# Altium project FMC_ADC_100M_10B_16CHA_TDC.PrjPCB (part 4 of 4)

## Sheet Translators.SchDoc: FMC_ADC
size 420 x 297 mm; Author: G.Kasprowicz; CompanyName: WUT ISE; DrawnBy: G.Kasprowicz; Organization: WUT ISE; Address1: PW ISE; Address2: Nowowiejska 15/19 00-665 Warsaw; Address3: gkasprow@gmail.com; DocumentNumber: 12; Revision: 2; SheetNumber: 12; SheetTotal: 12; ModifiedBy: -; CheckedDate: -; Title2: 100M_10B_16CHA_TDC; DivGrp: WUT ISE; Designer: G.Kasprowicz; ModifiedDate: -; ProjectName: Sensor Box
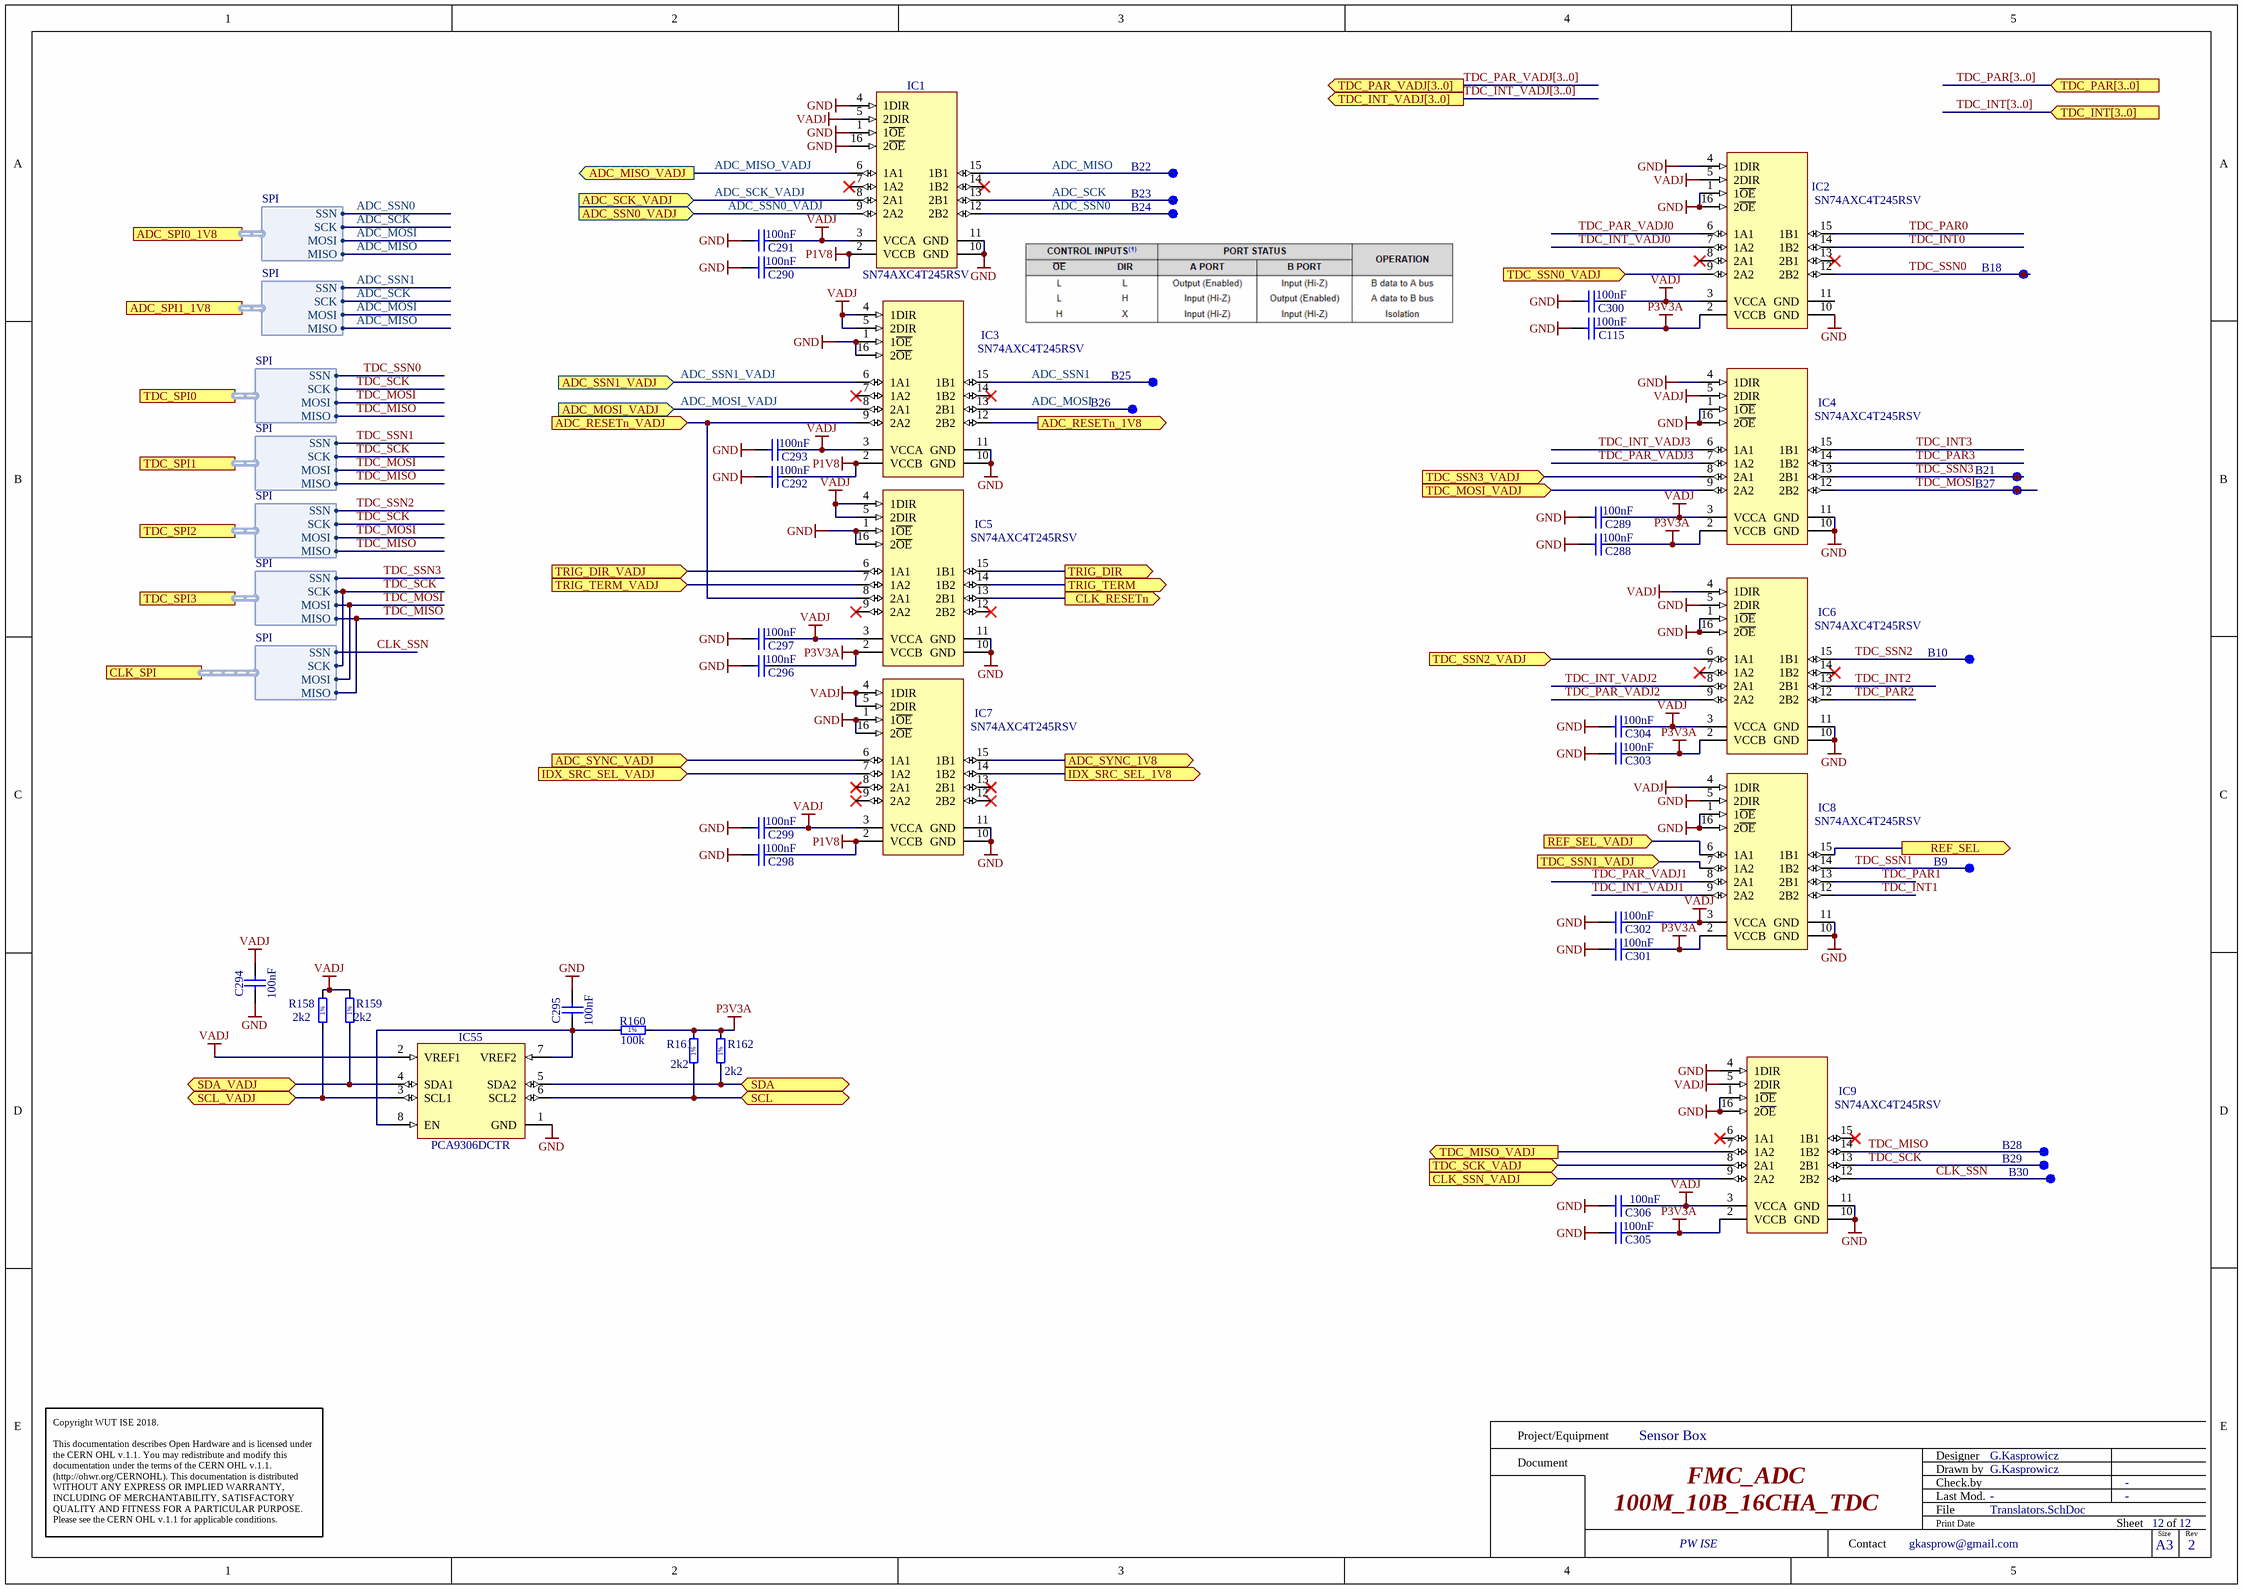
[diagram p10: Translators.SchDoc]

### Parts
B9  SMD Pad  [C100]  (value not drawn)
B10  SMD Pad  [C100]  (value not drawn)
B18  SMD Pad  [C100]  (value not drawn)
B21  SMD Pad  [C100]  (value not drawn)
B22  SMD Pad  [C100]  (value not drawn)
B23  SMD Pad  [C100]  (value not drawn)
B24  SMD Pad  [C100]  (value not drawn)
B25  SMD Pad  [C100]  (value not drawn)
B26  SMD Pad  [C100]  (value not drawn)
B27  SMD Pad  [C100]  (value not drawn)
B28  SMD Pad  [C100]  (value not drawn)
B29  SMD Pad  [C100]  (value not drawn)
B30  SMD Pad  [C100]  (value not drawn)
C115  100nF  [CAPC0603X33N]
C288  100nF  [CAPC0603X33N]
C289  100nF  [CAPC0603X33N]
C290  100nF  [CAPC0603X33N]
C291  100nF  [CAPC0603X33N]
C292  100nF  [CAPC0603X33N]
C293  100nF  [CAPC0603X33N]
C294  100nF  [CAPC0603X33N]
C295  100nF  [CAPC0603X33N]
C296  100nF  [CAPC0603X33N]
C297  100nF  [CAPC0603X33N]
C298  100nF  [CAPC0603X33N]
C299  100nF  [CAPC0603X33N]
C300  100nF  [CAPC0603X33N]
C301  100nF  [CAPC0603X33N]
C302  100nF  [CAPC0603X33N]
C303  100nF  [CAPC0603X33N]
C304  100nF  [CAPC0603X33N]
C305  100nF  [CAPC0603X33N]
C306  100nF  [CAPC0603X33N]
IC1  SN74AXC4T245RSV  [QFN40P180X260X55-16N]
IC2  SN74AXC4T245RSV  [QFN40P180X260X55-16N]
IC3  SN74AXC4T245RSV  [QFN40P180X260X55-16N]
IC4  SN74AXC4T245RSV  [QFN40P180X260X55-16N]
IC5  SN74AXC4T245RSV  [QFN40P180X260X55-16N]
IC6  SN74AXC4T245RSV  [QFN40P180X260X55-16N]
IC7  SN74AXC4T245RSV  [QFN40P180X260X55-16N]
IC8  SN74AXC4T245RSV  [QFN40P180X260X55-16N]
IC9  SN74AXC4T245RSV  [QFN40P180X260X55-16N]
IC55  PCA9306DCTR  [SOP65P400X130-8N]
R158  2k2  [RESC1005X40N]
R159  2k2  [RESC1005X40N]
R160  100k  [RESC1005X40N]
R161  2k2  [RESC1005X40N]
R162  2k2  [RESC1005X40N]

### Ports
ADC_MISO_VADJ (out), ADC_MOSI_VADJ (in), ADC_RESETn_1V8 (out), ADC_RESETn_VADJ (in), ADC_SCK_VADJ (in), ADC_SPI0_1V8 (harness SPI), ADC_SPI1_1V8 (harness SPI), ADC_SSN0_VADJ (in), ADC_SSN1_VADJ (in), ADC_SYNC_1V8 (out), ADC_SYNC_VADJ (in), CLK_RESETn (out), CLK_SPI (harness SPI), CLK_SSN_VADJ (in), IDX_SRC_SEL_1V8 (out), IDX_SRC_SEL_VADJ (in), REF_SEL (out), REF_SEL_VADJ (in), SCL (bidir), SCL_VADJ (bidir), SDA (bidir), SDA_VADJ (bidir), TDC_INT[3..0] (in), TDC_INT_VADJ[3..0] (out), TDC_MISO_VADJ (out), TDC_MOSI_VADJ (in), TDC_PAR[3..0] (in), TDC_PAR_VADJ[3..0] (out), TDC_SCK_VADJ (in), TDC_SPI0 (harness SPI), TDC_SPI1 (harness SPI), TDC_SPI2 (harness SPI), TDC_SPI3 (harness SPI), TDC_SSN0_VADJ (in), TDC_SSN1_VADJ (in), TDC_SSN2_VADJ (in), TDC_SSN3_VADJ (in), TRIG_DIR (out), TRIG_DIR_VADJ (in), TRIG_TERM (out), TRIG_TERM_VADJ (in)

### Harnesses
SPI: MISO, MOSI, SCK, SSN

### Nets
GND: C115.2 C288.2 C289.2 C290.2 C291.2 C292.2 C293.2 C294.1 C295.2 C296.2 C297.2 C298.2 C299.2 C300.2 C301.2 C302.2 C303.2 C304.2 C305.2 C306.2 IC1.1(1~{OE}) IC1.4(1DIR) IC1.10(GND) IC1.11(GND) IC1.16(2~{OE}) IC2.1(1~{OE}) IC2.4(1DIR) IC2.10(GND) IC2.16(2~{OE}) IC3.1(1~{OE}) IC3.10(GND) IC3.11(GND) IC3.16(2~{OE}) IC4.1(1~{OE}) IC4.4(1DIR) IC4.10(GND) IC4.11(GND) IC4.16(2~{OE}) IC5.1(1~{OE}) IC5.10(GND) IC5.11(GND) IC5.16(2~{OE}) IC6.1(1~{OE}) IC6.5(2DIR) IC6.10(GND) IC6.11(GND) IC6.16(2~{OE}) IC7.1(1~{OE}) IC7.10(GND) IC7.11(GND) IC7.16(2~{OE}) IC8.1(1~{OE}) IC8.5(2DIR) IC8.10(GND) IC8.11(GND) IC8.16(2~{OE}) IC9.1(1~{OE}) IC9.4(1DIR) IC9.10(GND) IC9.11(GND) IC9.16(2~{OE}) IC55.1(GND)
P1V8: C290.1 C292.1 C298.1 IC1.2(VCCB) IC3.2(VCCB) IC7.2(VCCB)
P3V3A: C115.1 C288.1 C296.1 C301.1 C303.1 C305.1 IC2.2(VCCB) IC4.2(VCCB) IC5.2(VCCB) IC6.2(VCCB) IC8.2(VCCB) IC9.2(VCCB) R160.2 R161.2 R162.2  [project net DVDD33]
VADJ: C289.1 C291.1 C293.1 C294.2 C297.1 C299.1 C300.1 C302.1 C304.1 C306.1 IC1.3(VCCA) IC1.5(2DIR) IC2.3(VCCA) IC2.5(2DIR) IC3.3(VCCA) IC3.4(1DIR) IC3.5(2DIR) IC4.3(VCCA) IC4.5(2DIR) IC5.3(VCCA) IC5.4(1DIR) IC5.5(2DIR) IC6.3(VCCA) IC6.4(1DIR) IC7.3(VCCA) IC7.4(1DIR) IC7.5(2DIR) IC8.3(VCCA) IC8.4(1DIR) IC9.3(VCCA) IC9.5(2DIR) IC55.2(VREF1) R158.2 R159.2
ADC_MISO: B22.1 IC1.15(1B1) ; port ADC_SPI0_1V8.MISO, port ADC_SPI1_1V8.MISO
ADC_MISO_VADJ: IC1.6(1A1) ; port ADC_MISO_VADJ
ADC_MOSI: B26.1 IC3.13(2B1) ; port ADC_SPI0_1V8.MOSI, port ADC_SPI1_1V8.MOSI
ADC_MOSI_VADJ: IC3.8(2A1) ; port ADC_MOSI_VADJ
ADC_RESETn_1V8: IC3.12(2B2) ; port ADC_RESETn_1V8
ADC_SCK: B23.1 IC1.13(2B1) ; port ADC_SPI0_1V8.SCK, port ADC_SPI1_1V8.SCK
ADC_SCK_VADJ: IC1.8(2A1) ; port ADC_SCK_VADJ
ADC_SSN0: B24.1 IC1.12(2B2) ; port ADC_SPI0_1V8.SSN
ADC_SSN0_VADJ: IC1.9(2A2) ; port ADC_SSN0_VADJ
ADC_SSN1: B25.1 IC3.15(1B1) ; port ADC_SPI1_1V8.SSN
ADC_SSN1_VADJ: IC3.6(1A1) ; port ADC_SSN1_VADJ
ADC_SYNC_1V8: IC7.15(1B1) ; port ADC_SYNC_1V8
CLK_SSN: B30.1 IC9.12(2B2) ; port CLK_SPI.SSN
DAC_SCL: IC55.6(SCL2) R161.1 ; port SCL
DAC_SDA: IC55.5(SDA2) R162.1 ; port SDA
HA20_N: IC4.8(2A1) ; port TDC_SSN3_VADJ
IDX_SRC_SEL_1V8: IC7.14(1B2) ; port IDX_SRC_SEL_1V8
LA12_P: IC6.6(1A1) ; port TDC_SSN2_VADJ
LA13_N: IC5.6(1A1) ; port TRIG_DIR_VADJ
LA13_P: IC4.9(2A2) ; port TDC_MOSI_VADJ
LA14_N: IC9.9(2A2) ; port CLK_SSN_VADJ
LA14_P: IC5.7(1A2) ; port TRIG_TERM_VADJ
LA15_N: IC9.8(2A1) ; port TDC_SCK_VADJ
LA15_P: IC3.9(2A2) IC5.8(2A1) ; port ADC_RESETn_VADJ
LA16_N: IC9.7(1A2) ; port TDC_MISO_VADJ
LA27_N: IC55.3(SCL1) R158.1 ; port SCL_VADJ
LA27_P: IC55.4(SDA1) R159.1 ; port SDA_VADJ
LA29_P: IC8.6(1A1) ; port REF_SEL_VADJ
LA30_N: IC7.7(1A2) ; port IDX_SRC_SEL_VADJ
LA30_P: IC7.6(1A1) ; port ADC_SYNC_VADJ
LA31_N: IC2.9(2A2) ; port TDC_SSN0_VADJ
LA31_P: IC8.7(1A2) ; port TDC_SSN1_VADJ
REF_SEL: IC8.15(1B1) ; port REF_SEL
TDC_INT0: IC2.14(1B2)
TDC_INT1: IC8.12(2B2)
TDC_INT2: IC6.13(2B1)
TDC_INT3: IC4.15(1B1)
TDC_INT_VADJ0: IC2.7(1A2)  [project net LA33_N]
TDC_INT_VADJ1: IC8.9(2A2)  [project net LA28_N]
TDC_INT_VADJ2: IC6.8(2A1)  [project net LA12_N]
TDC_INT_VADJ3: IC4.6(1A1)  [project net HA19_P]
TDC_MISO: B28.1 IC9.14(1B2) ; port TDC_SPI0.MISO, port TDC_SPI1.MISO, port TDC_SPI2.MISO, port TDC_SPI3.MISO, port CLK_SPI.MISO
TDC_MOSI: B27.1 IC4.12(2B2) ; port TDC_SPI0.MOSI, port TDC_SPI1.MOSI, port TDC_SPI2.MOSI, port TDC_SPI3.MOSI, port CLK_SPI.MOSI
TDC_PAR0: IC2.15(1B1)
TDC_PAR1: IC8.13(2B1)
TDC_PAR2: IC6.12(2B2)
TDC_PAR3: IC4.14(1B2)
TDC_PAR_VADJ0: IC2.6(1A1)  [project net LA33_P]
TDC_PAR_VADJ1: IC8.8(2A1)  [project net LA28_P]
TDC_PAR_VADJ2: IC6.9(2A2)  [project net LA11_P]
TDC_PAR_VADJ3: IC4.7(1A2)  [project net HA19_N]
TDC_SCK: B29.1 IC9.13(2B1) ; port TDC_SPI0.SCK, port TDC_SPI1.SCK, port TDC_SPI2.SCK, port TDC_SPI3.SCK, port CLK_SPI.SCK
TDC_SSN0: B18.1 IC2.12(2B2) ; port TDC_SPI0.SSN
TDC_SSN1: B9.1 IC8.14(1B2) ; port TDC_SPI1.SSN
TDC_SSN2: B10.1 IC6.15(1B1) ; port TDC_SPI2.SSN
TDC_SSN3: B21.1 IC4.13(2B1) ; port TDC_SPI3.SSN
TRIG_DIR: IC5.15(1B1) ; port TRIG_DIR
TRIG_TERM: IC5.14(1B2) ; port TRIG_TERM
NetC295_1: C295.1 IC55.7(VREF2) IC55.8(EN) R160.1
NetIC5_13: IC5.13(2B1) ; port CLK_RESETn

Not connected (* = marked no-connect by the designer): IC1 7(1A2)* 14(1B2)*; IC2 8(2A1)* 11(GND) 13(2B1)*; IC3 7(1A2)* 14(1B2)*; IC5 9(2A2)* 12(2B2)*; IC6 7(1A2)* 14(1B2)*; IC7 8(2A1)* 9(2A2)* 12(2B2)* 13(2B1)*; IC9 6(1A1)* 15(1B1)*

### Buses and harness runs
bus TDC_INT[3..0] = port TDC_INT[3..0]
bus TDC_INT_VADJ[3..0] = port TDC_INT_VADJ[3..0]
bus TDC_PAR[3..0] = port TDC_PAR[3..0]
bus TDC_PAR_VADJ[3..0] = port TDC_PAR_VADJ[3..0]

### Notes on the sheet
- Project/Equipment
- Document
- Designer
- Drawn by
- Check.by
- Copyright WUT ISE 2018.
  This documentation describes Open Hardware and is licensed under the CERN OHL v.1.1. You may redistribute and modify this documentation under the terms of the CERN OHL v.1.1. (http://ohwr.org/CERNOHL). This documentation is distributed WITHOUT ANY EXPRESS OR IMPLIED WARRANTY, INCLUDING OF MERCHANTABILITY, SATISFACTORY QUALITY AND FITNESS FOR A PARTICULAR PURPOSE. Please see the CERN OHL v.1.1 for applicable conditions.
- Contact
- File
- Last Mod.
- Print Date
- Sheet
- Size
- A3
- of
- Rev
- (in symbol R0402_2K2_1%_0.0625W_100PPM) 1%
- (in symbol R0402_100K_1%_0.0625W_100PPM) 1%

### Library data of the parts
B9 B10 B18 B21-B30 = SMD_PAD_D1MM: Through Hole Pad; Part Description: 1mm Diameter SMD Pad; Mounted: No; Part Number: SMD_PAD_D1MM; Component Kind: Standard (No BOM); Component Type: Standard (No BOM); Pin Count: 1; Family: SMD Pad; Socket: No; SMD: No; Sense: No; Status: None; ComponentHeight: 0mm; HelpURL: Undefined; Author: CERN DEM JLC; CreateDate: 10.10.2017; LatestRevisionDate: 10.10.2017; PackageDescription: 1mm Diameter SMD Pad
C115 C288-C306 = CC0201_100NF_6.3V_10%_X5R: Non-polarised capacitor; Manufacturer: GENERIC; Part Description: SMD Multilayer Chip Ceramic Capacitor; Manufacturer1 Part Number: 02016D104KAT2A; Tolerance: ±10%; Voltage: 6.3V; TC: X5R; Manufacturer Part Number: CC0201_100NF_6.3V_10%_X5R; Part Number: CC0201_100NF_6.3V_10%_X5R; Value: 100nF; Component Kind: Standard; Component Type: Standard; Pin Count: 2; Status: Not Recommended; Case: 0201; Mounted: Yes; Socket: No; SMD: Yes; Sense: No; Manufacturer1 Example: AVX; Manufacturer1 ComponentHeight: 0.33mm; HelpURL: \\cern.ch\dfs\Applications\Altium\Datasheets\CC0201_X5R_AVX.pdf; Author: CERN DEM JLC; CreateDate: 03.12.2007; LatestRevisionDate: 03.12.2007
IC1-IC9 = SN74AXC4T245: 4-Bit Dual-Supply Bus Transceiver with Configurable Voltage Translation and 3-State Output; Part Description: 4-Bit Dual-Supply Bus Transceiver With Configurable Voltage Translation and 3-State Outputs; Manufacturer: TEXAS INSTRUMENTS; PressFit: No; Bonding: No; Part Number: SN74AXC4T245RSV; Component Kind: Standard; Component Type: Standard; Device: SN74AXC4T245RSV; PackageDescription: QFN, 0.40mm Pitch, Rect.; 16 Pin, 2.60mm L X 1.80mm W X 0.55mm H Body, IPC Medium Density; Status: Recommended; Manufacturer Part Number: SN74AXC4T245RSV; Pin Count: 16; Case: QFN16; Mounted: Yes; Socket: No; SMD: Yes; Sense: No; ComponentHeight: 0.55mm; Author: GK; HelpURL: \\cern.ch\dfs\Applications\Altium\Datasheets\SN74AVC4T245RSVR.pdf; CreateDate: 08.07.2014; LatestRevisionDate: 30.03.2017
IC55 = PCA9306DCTR: Dual Bidirectional I2C Bus And SMBus Voltage-Level Translator; Manufacturer: TEXAS INSTRUMENTS; Table: Analog & Interface; Part Number: PCA9306DCTR; Component Kind: Standard; Component Type: Standard; Device: PCA9306DCTR; PackageDescription: SOP, 0.65mm, Pitch; 8 Pin, 2.80mm W X 2.95mm L X 1.30mm H Body, PC Medium Density; Part Description: Dual Bidirectional I2C Bus And SMBus Voltage-Level Translator; Manufacturer Part Number: PCA9306DCTR; Pin Count: 8; Case: SSOP8; Mounted: Yes; Socket: No; SMD: Yes; ComponentHeight: 1.3mm; Author: CERN DEM JLC; HelpURL: \\cern.ch\dfs\Applications\Altium\Datasheets\PCA9306DCTR.pdf; CreateDate: 2013-02-25; LatestRevisionDate: 2013-02-25
R158 R159 R161 R162 = R0402_2K2_1%_0.0625W_100PPM: Resistor - 1%; Part Description: General Purpose Thick Film Chip Resistor; Manufacturer: GENERIC; Manufacturer1 Part Number: 232270672202L; TC: ±100ppm/°C; Table: Resistors SMD; Part Number: R0402_2K2_1%_0.0625W_100PPM; Component Kind: Standard; Component Type: Standard; Pin Count: 2; Value: 2k2; Status: Not recommended; Power: 0.0625W; Tolerance: ±1%; Manufacturer Part Number: R0402_2K2_1%_0.0625W_100PPM; Case: 0402; Mounted: Yes; Socket: No; SMD: Yes; Manufacturer1 Example: YAGEO PHYCOMP; Manufacturer1 ComponentHeight: 0.4mm; HelpURL: \\cern.ch\dfs\Applications\Altium\Datasheets\R0402_Phycomp_RC0402.pdf; Author: CERN DEM JLC; CreateDate: 2007-12-03; LatestRevisionDate: 2012-10-17
R160 = R0402_100K_1%_0.0625W_100PPM: Resistor - 1%; Part Description: General Purpose Thick Film Chip Resistor; Manufacturer: GENERIC; Manufacturer1 Part Number: 232270671004L; TC: ±100ppm/°C; Table: Resistors SMD; Part Number: R0402_100K_1%_0.0625W_100PPM; Component Kind: Standard; Component Type: Standard; Pin Count: 2; Value: 100k; Status: Not recommended; Power: 0.0625W; Tolerance: ±1%; Manufacturer Part Number: R0402_100K_1%_0.0625W_100PPM; Case: 0402; Mounted: Yes; Socket: No; SMD: Yes; Manufacturer1 Example: YAGEO PHYCOMP; Manufacturer1 ComponentHeight: 0.4mm; HelpURL: \\cern.ch\dfs\Applications\Altium\Datasheets\R0402_Phycomp_RC0402.pdf; Author: CERN DEM JLC; CreateDate: 2007-12-03; LatestRevisionDate: 2012-10-17

## Sheet SAS_Connectors.SchDoc: FMC_ADC
size 420 x 297 mm; Author: G.Kasprowicz; CompanyName: WUT ISE; DrawnBy: G.Kasprowicz; Organization: WUT ISE; Address1: PW ISE; Address2: Nowowiejska 15/19 00-665 Warsaw; Address3: gkasprow@gmail.com; DocumentNumber: 2; Revision: 2; SheetNumber: 2; SheetTotal: 12; ModifiedBy: -; CheckedDate: -; Title2: 100M_10B_16CHA_TDC; DivGrp: WUT ISE; Designer: G.Kasprowicz; ModifiedDate: -; ProjectName: Sensor Box
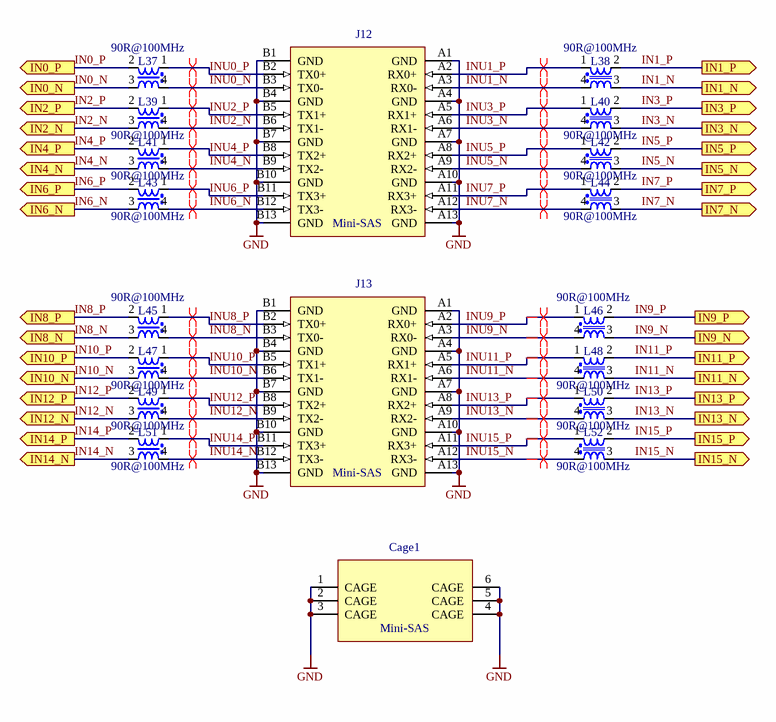
[diagram p11: SAS_Connectors.SchDoc]

### Parts
Cage1  Mini-SAS  [TYCO_1888321-2]
J12  Mini-SAS  [TYCO_1761987-7]
J13  Mini-SAS  [TYCO_1761987-7]
L37  90R@100MHz  [IND_MURATA_DLW21S]
L38  90R@100MHz  [IND_MURATA_DLW21S]
L39  90R@100MHz  [IND_MURATA_DLW21S]
L40  90R@100MHz  [IND_MURATA_DLW21S]
L41  90R@100MHz  [IND_MURATA_DLW21S]
L42  90R@100MHz  [IND_MURATA_DLW21S]
L43  90R@100MHz  [IND_MURATA_DLW21S]
L44  90R@100MHz  [IND_MURATA_DLW21S]
L45  90R@100MHz  [IND_MURATA_DLW21S]
L46  90R@100MHz  [IND_MURATA_DLW21S]
L47  90R@100MHz  [IND_MURATA_DLW21S]
L48  90R@100MHz  [IND_MURATA_DLW21S]
L49  90R@100MHz  [IND_MURATA_DLW21S]
L50  90R@100MHz  [IND_MURATA_DLW21S]
L51  90R@100MHz  [IND_MURATA_DLW21S]
L52  90R@100MHz  [IND_MURATA_DLW21S]

### Ports
IN0_N (out), IN0_P (out), IN1_N (out), IN1_P (out), IN2_N (out), IN2_P (out), IN3_N (out), IN3_P (out), IN4_N (out), IN4_P (out), IN5_N (out), IN5_P (out), IN6_N (out), IN6_P (out), IN7_N (out), IN7_P (out), IN8_N (out), IN8_P (out), IN9_N (out), IN9_P (out), IN10_N (out), IN10_P (out), IN11_N (out), IN11_P (out), IN12_N (out), IN12_P (out), IN13_N (out), IN13_P (out), IN14_N (out), IN14_P (out), IN15_N (out), IN15_P (out)

### Nets
GND: Cage1.1(CAGE) Cage1.2(CAGE) Cage1.3(CAGE) Cage1.4(CAGE) Cage1.5(CAGE) Cage1.6(CAGE) J12.A1(GND) J12.A4(GND) J12.A7(GND) J12.A10(GND) J12.A13(GND) J12.B1(GND) J12.B4(GND) J12.B7(GND) J12.B10(GND) J12.B13(GND) J13.A1(GND) J13.A4(GND) J13.A7(GND) J13.A10(GND) J13.A13(GND) J13.B1(GND) J13.B4(GND) J13.B7(GND) J13.B10(GND) J13.B13(GND)
IN0_N: L37.3 ; port IN0_N
IN0_P: L37.2 ; port IN0_P
IN1_N: L38.3 ; port IN1_N
IN1_P: L38.2 ; port IN1_P
IN2_N: L39.3 ; port IN2_N
IN2_P: L39.2 ; port IN2_P
IN3_N: L40.3 ; port IN3_N
IN3_P: L40.2 ; port IN3_P
IN4_N: L41.3 ; port IN4_N
IN4_P: L41.2 ; port IN4_P
IN5_N: L42.3 ; port IN5_N
IN5_P: L42.2 ; port IN5_P
IN6_N: L43.3 ; port IN6_N
IN6_P: L43.2 ; port IN6_P
IN7_N: L44.3 ; port IN7_N
IN7_P: L44.2 ; port IN7_P
IN8_N: L45.3 ; port IN8_N
IN8_P: L45.2 ; port IN8_P
IN9_N: L46.3 ; port IN9_N
IN9_P: L46.2 ; port IN9_P
IN10_N: L47.3 ; port IN10_N
IN10_P: L47.2 ; port IN10_P
IN11_N: L48.3 ; port IN11_N
IN11_P: L48.2 ; port IN11_P
IN12_N: L49.3 ; port IN12_N
IN12_P: L49.2 ; port IN12_P
IN13_N: L50.3 ; port IN13_N
IN13_P: L50.2 ; port IN13_P
IN14_N: L51.3 ; port IN14_N
IN14_P: L51.2 ; port IN14_P
IN15_N: L52.3 ; port IN15_N
IN15_P: L52.2 ; port IN15_P
INU0_N: J12.B3(TX0-) L37.4
INU0_P: J12.B2(TX0+) L37.1
INU1_N: J12.A3(RX0-) L38.4
INU1_P: J12.A2(RX0+) L38.1
INU2_N: J12.B6(TX1-) L39.4
INU2_P: J12.B5(TX1+) L39.1
INU3_N: J12.A6(RX1-) L40.4
INU3_P: J12.A5(RX1+) L40.1
INU4_N: J12.B9(TX2-) L41.4
INU4_P: J12.B8(TX2+) L41.1
INU5_N: J12.A9(RX2-) L42.4
INU5_P: J12.A8(RX2+) L42.1
INU6_N: J12.B12(TX3-) L43.4
INU6_P: J12.B11(TX3+) L43.1
INU7_N: J12.A12(RX3-) L44.4
INU7_P: J12.A11(RX3+) L44.1
INU8_N: J13.B3(TX0-) L45.4
INU8_P: J13.B2(TX0+) L45.1
INU9_N: J13.A3(RX0-) L46.4
INU9_P: J13.A2(RX0+) L46.1
INU10_N: J13.B6(TX1-) L47.4
INU10_P: J13.B5(TX1+) L47.1
INU11_N: J13.A6(RX1-) L48.4
INU11_P: J13.A5(RX1+) L48.1
INU12_N: J13.B9(TX2-) L49.4
INU12_P: J13.B8(TX2+) L49.1
INU13_N: J13.A9(RX2-) L50.4
INU13_P: J13.A8(RX2+) L50.1
INU14_N: J13.B12(TX3-) L51.4
INU14_P: J13.B11(TX3+) L51.1
INU15_N: J13.A12(RX3-) L52.4
INU15_P: J13.A11(RX3+) L52.1

### Layout directives
differential pair: INU0_N, INU0_P, INU1_N, INU1_P, INU2_N, INU2_P, INU3_N, INU3_P, INU4_N, INU4_P, INU5_N, INU5_P, INU6_N, INU6_P, INU7_N, INU7_P, INU8_N, INU8_P, INU9_N, INU9_P, INU10_N, INU10_P, INU11_N, INU11_P, INU12_N, INU12_P, INU13_N, INU13_P, INU14_N, INU14_P, INU15_N, INU15_P

### Notes on the sheet
- Project/Equipment
- Document
- Designer
- Drawn by
- Check.by
- Copyright WUT ISE 2018.
  This documentation describes Open Hardware and is licensed under the CERN OHL v.1.1. You may redistribute and modify this documentation under the terms of the CERN OHL v.1.1. (http://ohwr.org/CERNOHL). This documentation is distributed WITHOUT ANY EXPRESS OR IMPLIED WARRANTY, INCLUDING OF MERCHANTABILITY, SATISFACTORY QUALITY AND FITNESS FOR A PARTICULAR PURPOSE. Please see the CERN OHL v.1.1 for applicable conditions.
- Contact
- File
- Last Mod.
- Print Date
- Sheet
- Size
- A3
- of
- Rev

### Library data of the parts
Cage1 = TYCO_1888321-2: Mini-SAS Cage (6Pins); Part Description: Through Hole Dual Port EVERCLEAR Mini-SAS Cage; Manufacturer: TYCO ELECTRONICS; PressFit: No; Part Number: TYCO_1888321-2; Component Kind: Standard; Component Type: Standard; Pin Count: 10; Family: Mini-SAS; Mounted: Yes; Socket: No; SMD: No; Sense: No; Status: None; Manufacturer Part Number: 1888321-2; ComponentHeight: 8.63mm; HelpURL: \\cern.ch\dfs\Applications\Altium\Datasheets\TYCO_1888321-2.pdf; Author: CERN DEM BC; CreateDate: 04.04.2019; LatestRevisionDate: 04.04.2019
J12 J13 = TYCO_1761987-7: 26 Position Mini-Sas Connector (Quad Small Form-Factor SFF-8088); Part Description: Surface Mount EVERCLEAR Mini-SAS Right Angle Receptacle (Quad Small Form-Factor SFF-8088); Manufacturer: TYCO ELECTRONICS; PressFit: No; Part Number: TYCO_1761987-7; Component Kind: Standard; Component Type: Standard; Pin Count: 26; Family: Mini-SAS; Mounted: Yes; Socket: No; SMD: Yes; Sense: No; Status: None; Manufacturer Part Number: 1761987-7; ComponentHeight: 5.55mm; HelpURL: \\cern.ch\dfs\Applications\Altium\Datasheets\TYCO_1761987-7.pdf; Author: CERN DEM MR; CreateDate: 24.04.2019; LatestRevisionDate: 24.04.2019
L37-L52 = IND_MURATA_DLW21SN900SQ2L: Inductor Common Mode; Part Description: Wire Wound Common Mode Choke Coil (DLW21S Series); Manufacturer: MURATA; Power: 330mA; Resistance: 0.35R; Tolerance: ±25%; Part Number: IND_MURATA_DLW21SN900SQ2L; Component Kind: Standard; Component Type: Standard; Pin Count: 4; Value: 90R@100MHz; Status: None; Manufacturer Part Number: DLW21SN900SQ2L; Case: 0805; Mounted: Yes; Socket: No; SMD: Yes; Sense: No; ComponentHeight: 1.4mm; HelpURL: \\cern.ch\dfs\Applications\Altium\Datasheets\IND_MURATA_DLW21S.pdf; Author: CERN DEM JLC; CreateDate: 01.07.2014; LatestRevisionDate: 01.07.2014

## Nets that join several sheets
3P3VAUX: EEPROM_Temp (12 pins), FMC connector (J11.d32)
DVDD33: U_TDC0 (6 pins), power_supply (C275.1 J8.29 J8.30), IDX_CTRL (C181.1 C182.1 D3.2 IC41.8), U_TDC1 (6 pins), U_TDC2 (6 pins), U_TDC3 (6 pins), DACs (9 pins), Translators (15 pins)
GND: FMC_ADC_100M_10B_16CHA_TDC (J10.2 R118.1), U_ADC0 (20 pins), U_TDC0 (23 pins), Clock_circuit (33 pins), EEPROM_Temp (14 pins), FMC connector (164 pins), power_supply (13 pins), IDX_CTRL (10 pins), U_TDC1 (23 pins), U_TDC2 (23 pins), U_TDC3 (23 pins), U_CFD0 (9 pins), DACs (18 pins), U_CFD1 (9 pins), U_CFD2 (9 pins), U_CFD3 (9 pins), U_CFD4 (9 pins), U_CFD5 (9 pins), U_CFD6 (9 pins), U_CFD7 (9 pins), U_CFD8 (9 pins), U_CFD9 (9 pins), U_CFD10 (9 pins), U_CFD11 (9 pins), U_CFD12 (9 pins), U_CFD13 (9 pins), U_CFD14 (9 pins), U_CFD15 (9 pins), U_ADC1 (20 pins), Translators (62 pins), SAS_Connectors (26 pins)
N3V0A: power_supply (J8.7 J8.8), U_CFD0 (C102A.1 IC20A.6), U_CFD1 (C102B.1 IC20B.6), U_CFD2 (C102C.1 IC20C.6), U_CFD3 (C102D.1 IC20D.6), U_CFD4 (C102E.1 IC20E.6), U_CFD5 (C102F.1 IC20F.6), U_CFD6 (C102G.1 IC20G.6), U_CFD7 (C102H.1 IC20H.6), U_CFD8 (C102I.1 IC20I.6), U_CFD9 (C102J.1 IC20J.6), U_CFD10 (C102K.1 IC20K.6), U_CFD11 (C102L.1 IC20L.6), U_CFD12 (C102M.1 IC20M.6), U_CFD13 (C102N.1 IC20N.6), U_CFD14 (C102O.1 IC20O.6), U_CFD15 (C102P.1 IC20P.6)
P1V8: U_ADC0 (5 pins), power_supply (J8.17 J8.18), IDX_CTRL (L14.1), U_ADC1 (5 pins), Translators (6 pins)
P3V3: FMC connector (5 pins), power_supply (J8.21 J8.22), U_CFD0 (C105A.1 IC32A.5), U_CFD1 (C105B.1 IC32B.5), U_CFD2 (C105C.1 IC32C.5), U_CFD3 (C105D.1 IC32D.5), U_CFD4 (C105E.1 IC32E.5), U_CFD5 (C105F.1 IC32F.5), U_CFD6 (C105G.1 IC32G.5), U_CFD7 (C105H.1 IC32H.5), U_CFD8 (C105I.1 IC32I.5), U_CFD9 (C105J.1 IC32J.5), U_CFD10 (C105K.1 IC32K.5), U_CFD11 (C105L.1 IC32L.5), U_CFD12 (C105M.1 IC32M.5), U_CFD13 (C105N.1 IC32N.5), U_CFD14 (C105O.1 IC32O.5), U_CFD15 (C105P.1 IC32P.5)
P3V3_CLK: Clock_circuit (39 pins), power_supply (J8.1 J8.2)
P5V0A: power_supply (J8.13 J8.14), U_CFD0 (C101A.1 IC20A.3), U_CFD1 (C101B.1 IC20B.3), U_CFD2 (C101C.1 IC20C.3), U_CFD3 (C101D.1 IC20D.3), U_CFD4 (C101E.1 IC20E.3), U_CFD5 (C101F.1 IC20F.3), U_CFD6 (C101G.1 IC20G.3), U_CFD7 (C101H.1 IC20H.3), U_CFD8 (C101I.1 IC20I.3), U_CFD9 (C101J.1 IC20J.3), U_CFD10 (C101K.1 IC20K.3), U_CFD11 (C101L.1 IC20L.3), U_CFD12 (C101M.1 IC20M.3), U_CFD13 (C101N.1 IC20N.3), U_CFD14 (C101O.1 IC20O.3), U_CFD15 (C101P.1 IC20P.3)
P12V0: FMC connector (J11.c35 J11.c37), power_supply (J8.3 J8.4)
REF2V5: FMC_ADC_100M_10B_16CHA_TDC (R117.1), DACs (C147.1 IC35.8 IC36.8 IC37.2)
VADJ: FMC connector (J11.e39 J11.f40 J11.g39 J11.h40), power_supply (R138.1), Translators (34 pins)
ADC_CLK_N: U_ADC0 (C98A.1 R47A.1), Clock_circuit (IC34.38)
ADC_CLK_N: Clock_circuit (IC34.53), U_ADC1 (C98B.1 R47B.1)
ADC_CLK_P: U_ADC0 (C97A.1 R47A.2), Clock_circuit (IC34.37)
ADC_CLK_P: Clock_circuit (IC34.52), U_ADC1 (C97B.1 R47B.2)
ADC_IN0.SIG_N: U_ADC0 (IC14A.11), U_CFD0 (C100A.1 R60A.2)
ADC_IN0.SIG_P: U_ADC0 (IC14A.10), U_CFD0 (R48A.2 R58A.2)
ADC_IN1.SIG_N: U_ADC0 (IC14A.8), U_CFD1 (C100B.1 R60B.2)
ADC_IN1.SIG_P: U_ADC0 (IC14A.7), U_CFD1 (R48B.2 R58B.2)
ADC_IN2.SIG_N: U_ADC0 (IC14A.5), U_CFD2 (C100C.1 R60C.2)
ADC_IN2.SIG_P: U_ADC0 (IC14A.4), U_CFD2 (R48C.2 R58C.2)
ADC_IN3.SIG_N: U_ADC0 (IC14A.2), U_CFD3 (C100D.1 R60D.2)
ADC_IN3.SIG_P: U_ADC0 (IC14A.1), U_CFD3 (R48D.2 R58D.2)
ADC_IN4.SIG_N: U_ADC0 (IC14A.48), U_CFD4 (C100E.1 R60E.2)
ADC_IN4.SIG_P: U_ADC0 (IC14A.47), U_CFD4 (R48E.2 R58E.2)
ADC_IN5.SIG_N: U_ADC0 (IC14A.45), U_CFD5 (C100F.1 R60F.2)
ADC_IN5.SIG_P: U_ADC0 (IC14A.44), U_CFD5 (R48F.2 R58F.2)
ADC_IN6.SIG_N: U_ADC0 (IC14A.42), U_CFD6 (C100G.1 R60G.2)
ADC_IN6.SIG_P: U_ADC0 (IC14A.41), U_CFD6 (R48G.2 R58G.2)
ADC_IN7.SIG_N: U_ADC0 (IC14A.39), U_CFD7 (C100H.1 R60H.2)
ADC_IN7.SIG_P: U_ADC0 (IC14A.38), U_CFD7 (R48H.2 R58H.2)
ADC_IN8.SIG_N: U_CFD8 (C100I.1 R60I.2), U_ADC1 (IC14B.11)
ADC_IN8.SIG_P: U_CFD8 (R48I.2 R58I.2), U_ADC1 (IC14B.10)
ADC_IN9.SIG_N: U_CFD9 (C100J.1 R60J.2), U_ADC1 (IC14B.8)
ADC_IN9.SIG_P: U_CFD9 (R48J.2 R58J.2), U_ADC1 (IC14B.7)
ADC_IN10.SIG_N: U_CFD10 (C100K.1 R60K.2), U_ADC1 (IC14B.5)
ADC_IN10.SIG_P: U_CFD10 (R48K.2 R58K.2), U_ADC1 (IC14B.4)
ADC_IN11.SIG_N: U_CFD11 (C100L.1 R60L.2), U_ADC1 (IC14B.2)
ADC_IN11.SIG_P: U_CFD11 (R48L.2 R58L.2), U_ADC1 (IC14B.1)
ADC_IN12.SIG_N: U_CFD12 (C100M.1 R60M.2), U_ADC1 (IC14B.48)
ADC_IN12.SIG_P: U_CFD12 (R48M.2 R58M.2), U_ADC1 (IC14B.47)
ADC_IN13.SIG_N: U_CFD13 (C100N.1 R60N.2), U_ADC1 (IC14B.45)
ADC_IN13.SIG_P: U_CFD13 (R48N.2 R58N.2), U_ADC1 (IC14B.44)
ADC_IN14.SIG_N: U_CFD14 (C100O.1 R60O.2), U_ADC1 (IC14B.42)
ADC_IN14.SIG_P: U_CFD14 (R48O.2 R58O.2), U_ADC1 (IC14B.41)
ADC_IN15.SIG_N: U_CFD15 (C100P.1 R60P.2), U_ADC1 (IC14B.39)
ADC_IN15.SIG_P: U_CFD15 (R48P.2 R58P.2), U_ADC1 (IC14B.38)
ADC_MISO: U_ADC0 (IC15A.4), U_ADC1 (IC15B.4), Translators (B22.1 IC1.15)
ADC_MISO_VADJ: FMC connector (J11.k20), Translators (IC1.6)
ADC_MOSI: U_ADC0 (IC14A.62), U_ADC1 (IC14B.62), Translators (B26.1 IC3.13)
ADC_MOSI_VADJ: FMC connector (J11.g18), Translators (IC3.8)
ADC_RESETn_1V8: U_ADC0 (IC14A.64), U_ADC1 (IC14B.64), Translators (IC3.12)
ADC_SCK: U_ADC0 (IC14A.63), U_ADC1 (IC14B.63), Translators (B23.1 IC1.13)
ADC_SCK_VADJ: FMC connector (J11.j21), Translators (IC1.8)
ADC_SSN0: U_ADC0 (IC14A.61 IC15A.1), Translators (B24.1 IC1.12)
ADC_SSN0_VADJ: FMC connector (J11.j22), Translators (IC1.9)
ADC_SSN1: U_ADC1 (IC14B.61 IC15B.1), Translators (B25.1 IC3.15)
ADC_SSN1_VADJ: FMC connector (J11.h17), Translators (IC3.6)
ADC_SYNC_1V8: U_ADC0 (IC14A.49), U_ADC1 (IC14B.49), Translators (IC7.15)
ADCLK_N: U_ADC0 (IC14A.24), FMC connector (J11.k26)
ADCLK_N: FMC connector (J11.k17), U_ADC1 (IC14B.24)
ADCLK_P: U_ADC0 (IC14A.23), FMC connector (J11.k25)
ADCLK_P: FMC connector (J11.k16), U_ADC1 (IC14B.23)
CFD_CLAMP: FMC_ADC_100M_10B_16CHA_TDC (R117.2 R118.2), U_CFD0 (IC20A.7), U_CFD1 (IC20B.7), U_CFD2 (IC20C.7), U_CFD3 (IC20D.7), U_CFD4 (IC20E.7), U_CFD5 (IC20F.7), U_CFD6 (IC20G.7), U_CFD7 (IC20H.7), U_CFD8 (IC20I.7), U_CFD9 (IC20J.7), U_CFD10 (IC20K.7), U_CFD11 (IC20L.7), U_CFD12 (IC20M.7), U_CFD13 (IC20N.7), U_CFD14 (IC20O.7), U_CFD15 (IC20P.7)
CFD_OFFSET0: U_CFD0 (R70A.1), DACs (IC35.3)
CFD_OFFSET1: DACs (IC35.16), U_CFD1 (R70B.1)
CFD_OFFSET2: DACs (IC35.4), U_CFD2 (R70C.1)
CFD_OFFSET3: DACs (IC35.15), U_CFD3 (R70D.1)
CFD_OFFSET4: DACs (IC35.5), U_CFD4 (R70E.1)
CFD_OFFSET5: DACs (IC35.14), U_CFD5 (R70F.1)
CFD_OFFSET6: DACs (IC35.6), U_CFD6 (R70G.1)
CFD_OFFSET7: DACs (IC35.13), U_CFD7 (R70H.1)
CFD_OFFSET8: DACs (IC36.3), U_CFD8 (R70I.1)
CFD_OFFSET9: DACs (IC36.16), U_CFD9 (R70J.1)
CFD_OFFSET10: DACs (IC36.4), U_CFD10 (R70K.1)
CFD_OFFSET11: DACs (IC36.15), U_CFD11 (R70L.1)
CFD_OFFSET12: DACs (IC36.5), U_CFD12 (R70M.1)
CFD_OFFSET13: DACs (IC36.14), U_CFD13 (R70N.1)
CFD_OFFSET14: DACs (IC36.6), U_CFD14 (R70O.1)
CFD_OFFSET15: DACs (IC36.13), U_CFD15 (R70P.1)
CFD_OUT0.SIG_N: U_TDC0 (IC50A.48 R140A.2), U_CFD0 (IC32A.3)
CFD_OUT0.SIG_P: U_TDC0 (IC50A.47 R140A.1), U_CFD0 (IC32A.4)
CFD_OUT1.SIG_N: U_TDC0 (IC50A.46 R141A.2), U_CFD1 (IC32B.3)
CFD_OUT1.SIG_P: U_TDC0 (IC50A.45 R141A.1), U_CFD1 (IC32B.4)
CFD_OUT2.SIG_N: U_TDC0 (IC50A.36 R142A.2), U_CFD2 (IC32C.3)
CFD_OUT2.SIG_P: U_TDC0 (IC50A.35 R142A.1), U_CFD2 (IC32C.4)
CFD_OUT3.SIG_N: U_TDC0 (IC50A.34 R143A.2), U_CFD3 (IC32D.3)
CFD_OUT3.SIG_P: U_TDC0 (IC50A.33 R143A.1), U_CFD3 (IC32D.4)
CFD_OUT4.SIG_N: U_TDC1 (IC50B.48 R140B.2), U_CFD4 (IC32E.3)
CFD_OUT4.SIG_P: U_TDC1 (IC50B.47 R140B.1), U_CFD4 (IC32E.4)
CFD_OUT5.SIG_N: U_TDC1 (IC50B.46 R141B.2), U_CFD5 (IC32F.3)
CFD_OUT5.SIG_P: U_TDC1 (IC50B.45 R141B.1), U_CFD5 (IC32F.4)
CFD_OUT6.SIG_N: U_TDC1 (IC50B.36 R142B.2), U_CFD6 (IC32G.3)
CFD_OUT6.SIG_P: U_TDC1 (IC50B.35 R142B.1), U_CFD6 (IC32G.4)
CFD_OUT7.SIG_N: U_TDC1 (IC50B.34 R143B.2), U_CFD7 (IC32H.3)
CFD_OUT7.SIG_P: U_TDC1 (IC50B.33 R143B.1), U_CFD7 (IC32H.4)
CFD_OUT8.SIG_N: U_TDC2 (IC50C.48 R140C.2), U_CFD8 (IC32I.3)
CFD_OUT8.SIG_P: U_TDC2 (IC50C.47 R140C.1), U_CFD8 (IC32I.4)
CFD_OUT9.SIG_N: U_TDC2 (IC50C.46 R141C.2), U_CFD9 (IC32J.3)
CFD_OUT9.SIG_P: U_TDC2 (IC50C.45 R141C.1), U_CFD9 (IC32J.4)
CFD_OUT10.SIG_N: U_TDC2 (IC50C.36 R142C.2), U_CFD10 (IC32K.3)
CFD_OUT10.SIG_P: U_TDC2 (IC50C.35 R142C.1), U_CFD10 (IC32K.4)
CFD_OUT11.SIG_N: U_TDC2 (IC50C.34 R143C.2), U_CFD11 (IC32L.3)
CFD_OUT11.SIG_P: U_TDC2 (IC50C.33 R143C.1), U_CFD11 (IC32L.4)
CFD_OUT12.SIG_N: U_TDC3 (IC50D.48 R140D.2), U_CFD12 (IC32M.3)
CFD_OUT12.SIG_P: U_TDC3 (IC50D.47 R140D.1), U_CFD12 (IC32M.4)
CFD_OUT13.SIG_N: U_TDC3 (IC50D.46 R141D.2), U_CFD13 (IC32N.3)
CFD_OUT13.SIG_P: U_TDC3 (IC50D.45 R141D.1), U_CFD13 (IC32N.4)
CFD_OUT14.SIG_N: U_TDC3 (IC50D.36 R142D.2), U_CFD14 (IC32O.3)
CFD_OUT14.SIG_P: U_TDC3 (IC50D.35 R142D.1), U_CFD14 (IC32O.4)
CFD_OUT15.SIG_N: U_TDC3 (IC50D.34 R143D.2), U_CFD15 (IC32P.3)
CFD_OUT15.SIG_P: U_TDC3 (IC50D.33 R143D.1), U_CFD15 (IC32P.4)
CLK0_M2C_N: Clock_circuit (IC34.32), FMC connector (J11.h5)
CLK0_M2C_P: Clock_circuit (IC34.31), FMC connector (J11.h4)
CLK1_M2C_N: Clock_circuit (IC34.61), FMC connector (J11.g3)
CLK1_M2C_P: Clock_circuit (IC34.62), FMC connector (J11.g2)
CLK2_BIDIR_N: FMC connector (J11.k5), IDX_CTRL (R3.1)
CLK2_BIDIR_P: FMC connector (J11.k4), IDX_CTRL (R2.1)
CLK_SSN: Clock_circuit (IC34.21), Translators (B30.1 IC9.12)
DAC_SCL: DACs (B12.1 IC35.20 IC36.20), Translators (IC55.6 R161.1)
DAC_SDA: DACs (B13.1 IC35.19 IC36.19), Translators (IC55.5 R162.1)
DISABLE_N: U_TDC0 (IC50A.39 R139A.2), FMC connector (J11.k32)
DISABLE_N: FMC connector (J11.c15), U_TDC3 (IC50D.39 R139D.2)
DISABLE_N: FMC connector (J11.d9), U_TDC2 (IC50C.39 R139C.2)
DISABLE_N: FMC connector (J11.k23), U_TDC1 (IC50B.39 R139B.2)
DISABLE_P: U_TDC0 (IC50A.38 R139A.1), FMC connector (J11.k31)
DISABLE_P: FMC connector (J11.c14), U_TDC3 (IC50D.38 R139D.1)
DISABLE_P: FMC connector (J11.d8), U_TDC2 (IC50C.38 R139C.1)
DISABLE_P: FMC connector (J11.k22), U_TDC1 (IC50B.38 R139B.1)
FRAME0_N: U_TDC0 (IC50A.1), FMC connector (J11.f38)
FRAME0_N: FMC connector (J11.d15), U_TDC2 (IC50C.1)
FRAME0_N: FMC connector (J11.h29), U_TDC1 (IC50B.1)
FRAME0_N: FMC connector (J11.k8), U_TDC3 (IC50D.1)
FRAME0_P: U_TDC0 (IC50A.2), FMC connector (J11.f37)
FRAME0_P: FMC connector (J11.d14), U_TDC2 (IC50C.2)
FRAME0_P: FMC connector (J11.h28), U_TDC1 (IC50B.2)
FRAME0_P: FMC connector (J11.k7), U_TDC3 (IC50D.2)
FRAME1_N: U_TDC0 (IC50A.5), FMC connector (J11.j34)
FRAME1_N: FMC connector (J11.d27), U_TDC1 (IC50B.5)
FRAME1_N: FMC connector (J11.j10), U_TDC3 (IC50D.5)
FRAME1_N: FMC connector (J11.g13), U_TDC2 (IC50C.5)
FRAME1_P: U_TDC0 (IC50A.6), FMC connector (J11.j33)
FRAME1_P: FMC connector (J11.d26), U_TDC1 (IC50B.6)
FRAME1_P: FMC connector (J11.j9), U_TDC3 (IC50D.6)
FRAME1_P: FMC connector (J11.g12), U_TDC2 (IC50C.6)
FRAME2_N: U_TDC0 (IC50A.9), FMC connector (J11.e37)
FRAME2_N: FMC connector (J11.c11), U_TDC2 (IC50C.9)
FRAME2_N: FMC connector (J11.g25), U_TDC1 (IC50B.9)
FRAME2_N: FMC connector (J11.k11), U_TDC3 (IC50D.9)
FRAME2_P: U_TDC0 (IC50A.10), FMC connector (J11.e36)
FRAME2_P: FMC connector (J11.c10), U_TDC2 (IC50C.10)
FRAME2_P: FMC connector (J11.g24), U_TDC1 (IC50B.10)
FRAME2_P: FMC connector (J11.k10), U_TDC3 (IC50D.10)
FRAME3_N: U_TDC0 (IC50A.13), FMC connector (J11.k35)
FRAME3_N: FMC connector (J11.e7), U_TDC3 (IC50D.13)
FRAME3_N: FMC connector (J11.g10), U_TDC2 (IC50C.13)
FRAME3_N: FMC connector (J11.h23), U_TDC1 (IC50B.13)
FRAME3_P: U_TDC0 (IC50A.14), FMC connector (J11.k34)
FRAME3_P: FMC connector (J11.e6), U_TDC3 (IC50D.14)
FRAME3_P: FMC connector (J11.g9), U_TDC2 (IC50C.14)
FRAME3_P: FMC connector (J11.h22), U_TDC1 (IC50B.14)
GA0: EEPROM_Temp (IC40.2), FMC connector (J11.c34)
GA1: EEPROM_Temp (IC40.1), FMC connector (J11.d35)
HA00_CC_N: FMC connector (J11.f5), U_TDC3 (IC50D.17)
HA00_CC_P: FMC connector (J11.f4), U_TDC3 (IC50D.18)
HA01_CC_N: FMC connector (J11.e3), U_ADC1 (IC14B.26)
HA01_CC_P: FMC connector (J11.e2), U_ADC1 (IC14B.25)
HA03_N: FMC connector (J11.j7), U_TDC3 (IC50D.3)
HA03_P: FMC connector (J11.j6), U_TDC3 (IC50D.4)
HA04_N: FMC connector (J11.f8), U_TDC3 (IC50D.11)
HA04_P: FMC connector (J11.f7), U_TDC3 (IC50D.12)
HA08_N: FMC connector (J11.f11), U_TDC3 (IC50D.7)
HA08_P: FMC connector (J11.f10), U_TDC3 (IC50D.8)
HA09_N: FMC connector (J11.e10), U_TDC3 (IC50D.15)
HA09_P: FMC connector (J11.e9), U_TDC3 (IC50D.16)
HA10_N: FMC connector (J11.k14), U_ADC1 (IC14B.16)
HA10_P: FMC connector (J11.k13), U_ADC1 (IC14B.15)
HA11_N: FMC connector (J11.j13), U_ADC1 (IC14B.32)
HA11_P: FMC connector (J11.j12), U_ADC1 (IC14B.31)
HA12_N: FMC connector (J11.f14), U_ADC1 (IC14B.30)
HA12_P: FMC connector (J11.f13), U_ADC1 (IC14B.29)
HA13_N: FMC connector (J11.e13), U_ADC1 (IC14B.34)
HA13_P: FMC connector (J11.e12), U_ADC1 (IC14B.33)
HA14_N: FMC connector (J11.j16), U_ADC1 (IC14B.22)
HA14_P: FMC connector (J11.j15), U_ADC1 (IC14B.21)
HA15_N: FMC connector (J11.f17), U_ADC1 (IC14B.18)
HA15_P: FMC connector (J11.f16), U_ADC1 (IC14B.17)
HA16_N: FMC connector (J11.e16), U_ADC1 (IC14B.28)
HA16_P: FMC connector (J11.e15), U_ADC1 (IC14B.27)
HA18_N: FMC connector (J11.j19), U_ADC1 (IC14B.20)
HA18_P: FMC connector (J11.j18), U_ADC1 (IC14B.19)
HA19_N: FMC connector (J11.f20), Translators (IC4.7)
HA19_P: FMC connector (J11.f19), Translators (IC4.6)
HA20_N: FMC connector (J11.e19), Translators (IC4.8)
HB01_N: U_ADC0 (IC14A.34), FMC connector (J11.j25)
HB01_P: U_ADC0 (IC14A.33), FMC connector (J11.j24)
HB02_N: U_ADC0 (IC14A.16), FMC connector (J11.f23)
HB02_P: U_ADC0 (IC14A.15), FMC connector (J11.f22)
HB03_N: U_ADC0 (IC14A.22), FMC connector (J11.e22)
HB03_P: U_ADC0 (IC14A.21), FMC connector (J11.e21)
HB04_N: U_ADC0 (IC14A.32), FMC connector (J11.f26)
HB04_P: U_ADC0 (IC14A.31), FMC connector (J11.f25)
HB05_N: U_ADC0 (IC14A.28), FMC connector (J11.e25)
HB05_P: U_ADC0 (IC14A.27), FMC connector (J11.e24)
HB06_CC_N: U_ADC0 (IC14A.26), FMC connector (J11.k29)
HB06_CC_P: U_ADC0 (IC14A.25), FMC connector (J11.k28)
HB07_N: U_ADC0 (IC14A.30), FMC connector (J11.j28)
HB07_P: U_ADC0 (IC14A.29), FMC connector (J11.j27)
HB08_N: U_ADC0 (IC14A.20), FMC connector (J11.f29)
HB08_P: U_ADC0 (IC14A.19), FMC connector (J11.f28)
HB09_N: U_ADC0 (IC14A.18), FMC connector (J11.e28)
HB09_P: U_ADC0 (IC14A.17), FMC connector (J11.e27)
HB12_N: FMC connector (J11.f32), IDX_CTRL (IC41.7 R122.1)
HB12_P: FMC connector (J11.f31), IDX_CTRL (IC41.6 R122.2)
HB13_N: U_TDC0 (IC50A.3), FMC connector (J11.e31)
HB13_P: U_TDC0 (IC50A.4), FMC connector (J11.e30)
HB16_N: U_TDC0 (IC50A.11), FMC connector (J11.f35)
HB16_P: U_TDC0 (IC50A.12), FMC connector (J11.f34)
HB17_CC_N: U_TDC0 (IC50A.17), FMC connector (J11.k38)
HB17_CC_P: U_TDC0 (IC50A.18), FMC connector (J11.k37)
HB18_N: U_TDC0 (IC50A.15), FMC connector (J11.j37)
HB18_P: U_TDC0 (IC50A.16), FMC connector (J11.j36)
HB19_N: U_TDC0 (IC50A.7), FMC connector (J11.e34)
HB19_P: U_TDC0 (IC50A.8), FMC connector (J11.e33)
IDX0.SIG_N: U_TDC0 (IC50A.43 R144A.2), IDX_CTRL (IC42.10)
IDX0.SIG_P: U_TDC0 (IC50A.42 R144A.1), IDX_CTRL (IC42.9)
IDX1.SIG_N: IDX_CTRL (IC42.12), U_TDC1 (IC50B.43 R144B.2)
IDX1.SIG_P: IDX_CTRL (IC42.11), U_TDC1 (IC50B.42 R144B.1)
IDX2.SIG_N: IDX_CTRL (IC42.14), U_TDC2 (IC50C.43 R144C.2)
IDX2.SIG_P: IDX_CTRL (IC42.13), U_TDC2 (IC50C.42 R144C.1)
IDX3.SIG_N: IDX_CTRL (IC42.16), U_TDC3 (IC50D.43 R144D.2)
IDX3.SIG_P: IDX_CTRL (IC42.15), U_TDC3 (IC50D.42 R144D.1)
IDX_N: FMC connector (J11.h38), IDX_CTRL (IC42.4 R3.2 R124.2)
IDX_P: FMC connector (J11.h37), IDX_CTRL (IC42.3 R2.2 R124.1)
IDX_SRC_SEL_1V8: IDX_CTRL (IC42.2), Translators (IC7.14)
IN0_N: U_CFD0 (R63A.1 R65A.1), SAS_Connectors (L37.3)
IN0_P: U_CFD0 (R64A.1 R65A.2), SAS_Connectors (L37.2)
IN1_N: U_CFD1 (R63B.1 R65B.1), SAS_Connectors (L38.3)
IN1_P: U_CFD1 (R64B.1 R65B.2), SAS_Connectors (L38.2)
IN2_N: U_CFD2 (R63C.1 R65C.1), SAS_Connectors (L39.3)
IN2_P: U_CFD2 (R64C.1 R65C.2), SAS_Connectors (L39.2)
IN3_N: U_CFD3 (R63D.1 R65D.1), SAS_Connectors (L40.3)
IN3_P: U_CFD3 (R64D.1 R65D.2), SAS_Connectors (L40.2)
IN4_N: U_CFD4 (R63E.1 R65E.1), SAS_Connectors (L41.3)
IN4_P: U_CFD4 (R64E.1 R65E.2), SAS_Connectors (L41.2)
IN5_N: U_CFD5 (R63F.1 R65F.1), SAS_Connectors (L42.3)
IN5_P: U_CFD5 (R64F.1 R65F.2), SAS_Connectors (L42.2)
IN6_N: U_CFD6 (R63G.1 R65G.1), SAS_Connectors (L43.3)
IN6_P: U_CFD6 (R64G.1 R65G.2), SAS_Connectors (L43.2)
IN7_N: U_CFD7 (R63H.1 R65H.1), SAS_Connectors (L44.3)
IN7_P: U_CFD7 (R64H.1 R65H.2), SAS_Connectors (L44.2)
IN8_N: U_CFD8 (R63I.1 R65I.1), SAS_Connectors (L45.3)
IN8_P: U_CFD8 (R64I.1 R65I.2), SAS_Connectors (L45.2)
IN9_N: U_CFD9 (R63J.1 R65J.1), SAS_Connectors (L46.3)
IN9_P: U_CFD9 (R64J.1 R65J.2), SAS_Connectors (L46.2)
IN10_N: U_CFD10 (R63K.1 R65K.1), SAS_Connectors (L47.3)
IN10_P: U_CFD10 (R64K.1 R65K.2), SAS_Connectors (L47.2)
IN11_N: U_CFD11 (R63L.1 R65L.1), SAS_Connectors (L48.3)
IN11_P: U_CFD11 (R64L.1 R65L.2), SAS_Connectors (L48.2)
IN12_N: U_CFD12 (R63M.1 R65M.1), SAS_Connectors (L49.3)
IN12_P: U_CFD12 (R64M.1 R65M.2), SAS_Connectors (L49.2)
IN13_N: U_CFD13 (R63N.1 R65N.1), SAS_Connectors (L50.3)
IN13_P: U_CFD13 (R64N.1 R65N.2), SAS_Connectors (L50.2)
IN14_N: U_CFD14 (R63O.1 R65O.1), SAS_Connectors (L51.3)
IN14_P: U_CFD14 (R64O.1 R65O.2), SAS_Connectors (L51.2)
IN15_N: U_CFD15 (R63P.1 R65P.1), SAS_Connectors (L52.3)
IN15_P: U_CFD15 (R64P.1 R65P.2), SAS_Connectors (L52.2)
LA00_CC_N: FMC connector (J11.g7), U_TDC2 (IC50C.17)
LA00_CC_P: FMC connector (J11.g6), U_TDC2 (IC50C.18)
LA02_N: FMC connector (J11.h8), U_TDC2 (IC50C.15)
LA02_P: FMC connector (J11.h7), U_TDC2 (IC50C.16)
LA04_N: FMC connector (J11.h11), U_TDC2 (IC50C.11)
LA04_P: FMC connector (J11.h10), U_TDC2 (IC50C.12)
LA05_N: FMC connector (J11.d12), U_TDC2 (IC50C.7)
LA05_P: FMC connector (J11.d11), U_TDC2 (IC50C.8)
LA07_N: FMC connector (J11.h14), U_TDC2 (IC50C.3)
LA07_P: FMC connector (J11.h13), U_TDC2 (IC50C.4)
LA11_P: FMC connector (J11.h16), Translators (IC6.9)
LA12_N: FMC connector (J11.g16), Translators (IC6.8)
LA12_P: FMC connector (J11.g15), Translators (IC6.6)
LA13_N: FMC connector (J11.d18), Translators (IC5.6)
LA13_P: FMC connector (J11.d17), Translators (IC4.9)
LA14_N: FMC connector (J11.c19), Translators (IC9.9)
LA14_P: FMC connector (J11.c18), Translators (IC5.7)
LA15_N: FMC connector (J11.h20), Translators (IC9.8)
LA15_P: FMC connector (J11.h19), Translators (IC3.9 IC5.8)
LA16_N: FMC connector (J11.g19), Translators (IC9.7)
LA17_CC_N: FMC connector (J11.d21), U_TDC1 (IC50B.17)
LA17_CC_P: FMC connector (J11.d20), U_TDC1 (IC50B.18)
LA20_N: FMC connector (J11.g22), U_TDC1 (IC50B.15)
LA20_P: FMC connector (J11.g21), U_TDC1 (IC50B.16)
LA21_N: FMC connector (J11.h26), U_TDC1 (IC50B.7)
LA21_P: FMC connector (J11.h25), U_TDC1 (IC50B.8)
LA23_N: FMC connector (J11.d24), U_TDC1 (IC50B.11)
LA23_P: FMC connector (J11.d23), U_TDC1 (IC50B.12)
LA25_N: FMC connector (J11.g28), U_TDC1 (IC50B.3)
LA25_P: FMC connector (J11.g27), U_TDC1 (IC50B.4)
LA27_N: FMC connector (J11.c27), Translators (IC55.3 R158.1)
LA27_P: FMC connector (J11.c26), Translators (IC55.4 R159.1)
LA28_N: FMC connector (J11.h32), Translators (IC8.9)
LA28_P: FMC connector (J11.h31), Translators (IC8.8)
LA29_N: FMC connector (J11.g31), power_supply (J8.11 R138.2)
LA29_P: FMC connector (J11.g30), Translators (IC8.6)
LA30_N: FMC connector (J11.h35), Translators (IC7.7)
LA30_P: FMC connector (J11.h34), Translators (IC7.6)
LA31_N: FMC connector (J11.g34), Translators (IC2.9)
LA31_P: FMC connector (J11.g33), Translators (IC8.7)
LA33_N: FMC connector (J11.g37), Translators (IC2.7)
LA33_P: FMC connector (J11.g36), Translators (IC2.6)
LCLKIN_N: U_TDC0 (IC50A.64), Clock_circuit (IC34.35)
LCLKIN_N: Clock_circuit (IC34.47), U_TDC1 (IC50B.64)
LCLKIN_N: Clock_circuit (IC34.65), U_TDC2 (IC50C.64)
LCLKIN_N: Clock_circuit (IC34.68), U_TDC3 (IC50D.64)
LCLKIN_P: U_TDC0 (IC50A.63), Clock_circuit (IC34.34)
LCLKIN_P: Clock_circuit (IC34.46), U_TDC1 (IC50B.63)
LCLKIN_P: Clock_circuit (IC34.64), U_TDC2 (IC50C.63)
LCLKIN_P: Clock_circuit (IC34.67), U_TDC3 (IC50D.63)
NetD3_3: FMC_ADC_100M_10B_16CHA_TDC (J10.1), IDX_CTRL (5 pins)
NetIC5_13: Clock_circuit (IC34.19), Translators (IC5.13)
REF_SEL: Clock_circuit (IC34.4 R78.2), Translators (IC8.15)
REFA_N: Clock_circuit (IC34.3 R76.2), FMC connector (R121.1)
REFA_P: Clock_circuit (IC34.2 R76.1), FMC connector (R120.1)
REFCLK_N: U_TDC0 (IC50A.41 R145A.2), Clock_circuit (IC34.41)
REFCLK_N: Clock_circuit (IC34.44), U_TDC1 (IC50B.41 R145B.2)
REFCLK_N: Clock_circuit (IC34.50), U_TDC2 (IC50C.41 R145C.2)
REFCLK_N: Clock_circuit (IC34.59), U_TDC3 (IC50D.41 R145D.2)
REFCLK_P: U_TDC0 (IC50A.40 R145A.1), Clock_circuit (IC34.40)
REFCLK_P: Clock_circuit (IC34.43), U_TDC1 (IC50B.40 R145B.1)
REFCLK_P: Clock_circuit (IC34.49), U_TDC2 (IC50C.40 R145C.1)
REFCLK_P: Clock_circuit (IC34.58), U_TDC3 (IC50D.40 R145D.1)
SCL: EEPROM_Temp (B15.1 IC40.6 R114.2 R116.1), FMC connector (J11.c30)
SDA: EEPROM_Temp (B14.1 IC40.5 R113.2 R115.1), FMC connector (J11.c31)
TDC_INT0: U_TDC0 (IC50A.55), Translators (IC2.14)
TDC_INT1: U_TDC1 (IC50B.55), Translators (IC8.12)
TDC_INT2: U_TDC2 (IC50C.55), Translators (IC6.13)
TDC_INT3: U_TDC3 (IC50D.55), Translators (IC4.15)
TDC_MISO: U_TDC0 (IC50A.59), Clock_circuit (IC34.24), U_TDC1 (IC50B.59), U_TDC2 (IC50C.59), U_TDC3 (IC50D.59), Translators (B28.1 IC9.14)
TDC_MOSI: U_TDC0 (IC50A.58), Clock_circuit (IC34.23), U_TDC1 (IC50B.58), U_TDC2 (IC50C.58), U_TDC3 (IC50D.58), Translators (B27.1 IC4.12)
TDC_PAR0: U_TDC0 (IC50A.54), Translators (IC2.15)
TDC_PAR1: U_TDC1 (IC50B.54), Translators (IC8.13)
TDC_PAR2: U_TDC2 (IC50C.54), Translators (IC6.12)
TDC_PAR3: U_TDC3 (IC50D.54), Translators (IC4.14)
TDC_SCK: U_TDC0 (IC50A.57), Clock_circuit (IC34.22), U_TDC1 (IC50B.57), U_TDC2 (IC50C.57), U_TDC3 (IC50D.57), Translators (B29.1 IC9.13)
TDC_SSN0: U_TDC0 (IC50A.56), Translators (B18.1 IC2.12)
TDC_SSN1: U_TDC1 (IC50B.56), Translators (B9.1 IC8.14)
TDC_SSN2: U_TDC2 (IC50C.56), Translators (B10.1 IC6.15)
TDC_SSN3: U_TDC3 (IC50D.56), Translators (B21.1 IC4.13)
TEMP_ALARM: EEPROM_Temp (IC38.3 IC39.3 R105.1), power_supply (J8.9)
TRIG_DIR: IDX_CTRL (IC41.2 IC41.3), Translators (IC5.15)
TRIG_TERM: IDX_CTRL (T8.5), Translators (IC5.14)
VCM0: U_ADC0 (IC14A.53), U_CFD0 (C103A.1 IC20A.2), U_CFD1 (C103B.1 IC20B.2), U_CFD2 (C103C.1 IC20C.2), U_CFD3 (C103D.1 IC20D.2), U_CFD4 (C103E.1 IC20E.2), U_CFD5 (C103F.1 IC20F.2), U_CFD6 (C103G.1 IC20G.2), U_CFD7 (C103H.1 IC20H.2)
VCM1: U_CFD8 (C103I.1 IC20I.2), U_CFD9 (C103J.1 IC20J.2), U_CFD10 (C103K.1 IC20K.2), U_CFD11 (C103L.1 IC20L.2), U_CFD12 (C103M.1 IC20M.2), U_CFD13 (C103N.1 IC20N.2), U_CFD14 (C103O.1 IC20O.2), U_CFD15 (C103P.1 IC20P.2), U_ADC1 (IC14B.53)

## Assembly variants
Default: not fitted R124